# Altium schematic sheet NRF24L01_SPI#2.SchDoc
size A4
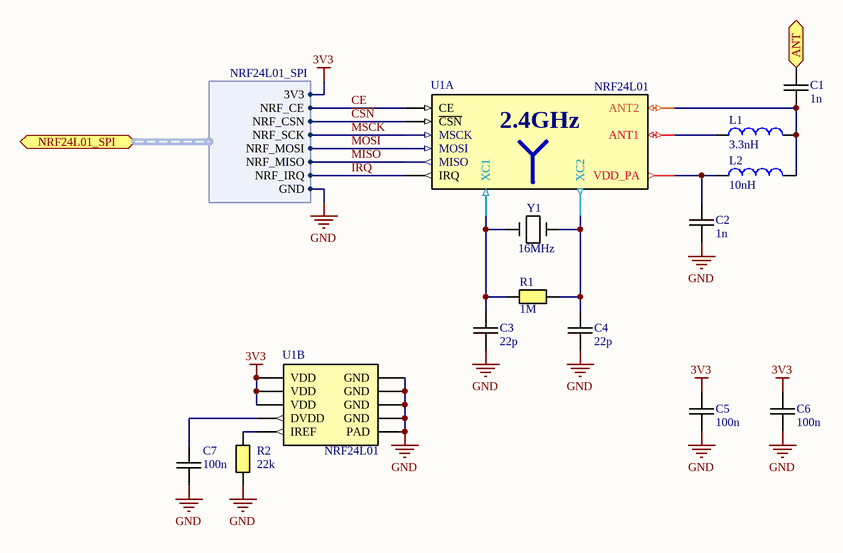
[diagram p0: NRF24L01_SPI#2.SchDoc]

## Parts
C1  1n  [CAPC0603(1608)55_N]
C2  1n  [CAPC0603(1608)55_N]
C3  22p  [CAPC0603(1608)55_N]
C4  22p  [CAPC0603(1608)55_N]
C5  100n  [CAPC0603(1608)55_N]
C6  100n  [CAPC0603(1608)55_N]
C7  100n  [CAPC0603(1608)55_N]
L1  3.3nH  [C_0603]
L2  10nH  [C_0603]
R1  1M  [RESC0603(1608)_N]
R2  22k  [RESC0603(1608)_N]
U1  NRF24L01  [QFN20]  (parts A,B of 2)
Y1  16MHz  [3225]

## Ports
ANT (out), NRF24L01_SPI (harness NRF24L01_SPI)

## Harnesses
NRF24L01_SPI: NRF_CE, NRF_CSN, NRF_SCK, NRF_MOSI, NRF_MISO, NRF_IRQ, 3V3, GND

## Nets
3V3: C5.1 C6.1 U1.7(VDD) U1.15(VDD) U1.18(VDD) ; port NRF24L01_SPI.3V3
GND: C2.2 C3.2 C4.2 C5.2 C6.2 C7.2 R2.1 U1.8(GND) U1.14(GND) U1.17(GND) U1.20(GND) U1.21(PAD) Y1.2 Y1.4 ; port NRF24L01_SPI.GND
ANT: C1.1 ; port ANT
~{CSN}: U1.2(~{CSN}) ; port NRF24L01_SPI.NRF_CSN
CE: U1.1(CE) ; port NRF24L01_SPI.NRF_CE
IRQ: U1.6(IRQ) ; port NRF24L01_SPI.NRF_IRQ
MISO: U1.5(MISO) ; port NRF24L01_SPI.NRF_MISO
MOSI: U1.4(MOSI) ; port NRF24L01_SPI.NRF_MOSI
MSCK: U1.3(MSCK) ; port NRF24L01_SPI.NRF_SCK
NetC1_2: C1.2 L1.2 L2.2 U1.13(ANT2)
NetC2_1: C2.1 L2.1 U1.11(VDD_PA)
NetC3_1: C3.1 R1.1 U1.10(XC1) Y1.1
NetC4_1: C4.1 R1.2 U1.9(XC2) Y1.3
NetC7_1: C7.1 U1.19(DVDD)
NetL1_1: L1.1 U1.12(ANT1)
NetR2_2: R2.2 U1.16(IREF)

## Notes on the sheet
- (in symbol NRF24L01, part A) 2.4GHz

## Library data of the parts
C1-C7 = Capacitor M: Ceramic capacitor Medium density
  C1 C2: Value: 1n
  C3 C4: Value: 22p
  C5-C7: Value: 100n
L1 L2 = Inductor
  L1: Value: 3.3nH
  L2: Value: 10nH
R1 R2 = Resistor M: Resistor Medium Density
  R1: Value: 1M
  R2: Value: 22k
U1 = NRF24L01: 2.4GHz WIRELESS TRANSIVER
Y1 = CRYSTAL: Value: 16MHz